# EAGLE design 2024-03-04_AD4882-to-INA317-Adapter (EAGLE 9.6.2)
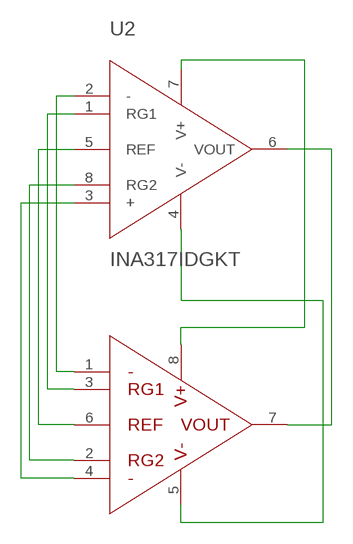
[diagram p0: schematic, sheet 1]

## Parts
U1  AD8422BRMZ-RL  [SOP65P490X110-8N]
U2  INA317IDGKT  [SOP65P490X110-8N]

## Nets
N$1: U1.1(-IN) U2.2(-)
N$2: U1.3(RG_2) U2.1(RG1)
N$3: U1.6(REF) U2.5(REF)
N$4: U1.2(RG_1) U2.8(RG2)
N$5: U1.4(+IN) U2.3(+)
N$6: U1.8(VS+) U2.7(V+)
N$7: U1.5(VS-) U2.4(V-)
N$8: U1.7(VOUT) U2.6(VOUT)

## Library data of the parts
U1 = AD8422BRMZ-RL:AD8422BRMZ-RL: INSTRUMENT AMP, 2.2MHZ, 80DB, 8 MSOP; No. of Amplifiers: 1; Input Offset Voltage: Check availability <https://pricing.snapeda.com/parts/AD8422BRMZ-RL/Analog%20Devices/view-part?ref=eda>; AVAILABILITY: In Stock; CHECK_PRICES: https://www.snapeda.com/parts/AD8422BRMZ-RL/Analog+Devices/view-part/?ref=eda; DESCRIPTION: High Performance, Low Power, Rail-to-Rail Precision Instrumentation Amplifier; MF: Analog Devices; MP: AD8422BRMZ-RL; PACKAGE: MSOP-8 Analog Devices; PRICE: None; PURCHASE-URL: https://www.snapeda.com/api/url_track_click_mouser/?unipart_id=972475&manufacturer=Analog Devices&part_name=AD8422BRMZ-RL&search_term=ad8422; SNAPEDA_LINK: https://www.snapeda.com/parts/AD8422BRMZ-RL/Analog+Devices/view-part/?ref=snap
U2 = INA317IDGKT:INA317IDGKT: Check availability <https://pricing.snapeda.com/parts/INA317IDGKT/Texas%20Instruments/view-part?ref=eda>; AVAILABILITY: In Stock; CHECK_PRICES: https://www.snapeda.com/parts/INA317IDGKT/Texas+Instruments/view-part/?ref=eda; DESCRIPTION: Micro-power (50µA), zero-drift (75µV offset, 0.3µV/˚C), precision RRO instrumentation amplifier; MF: Texas Instruments; MP: INA317IDGKT; PACKAGE: VSSOP-8 Texas Instruments; PRICE: None; PURCHASE-URL: https://www.snapeda.com/api/url_track_click_mouser/?unipart_id=3077446&manufacturer=Texas Instruments&part_name=INA317IDGKT&search_term=ina317; SNAPEDA_LINK: https://www.snapeda.com/parts/INA317IDGKT/Texas+Instruments/view-part/?ref=snap

## Board
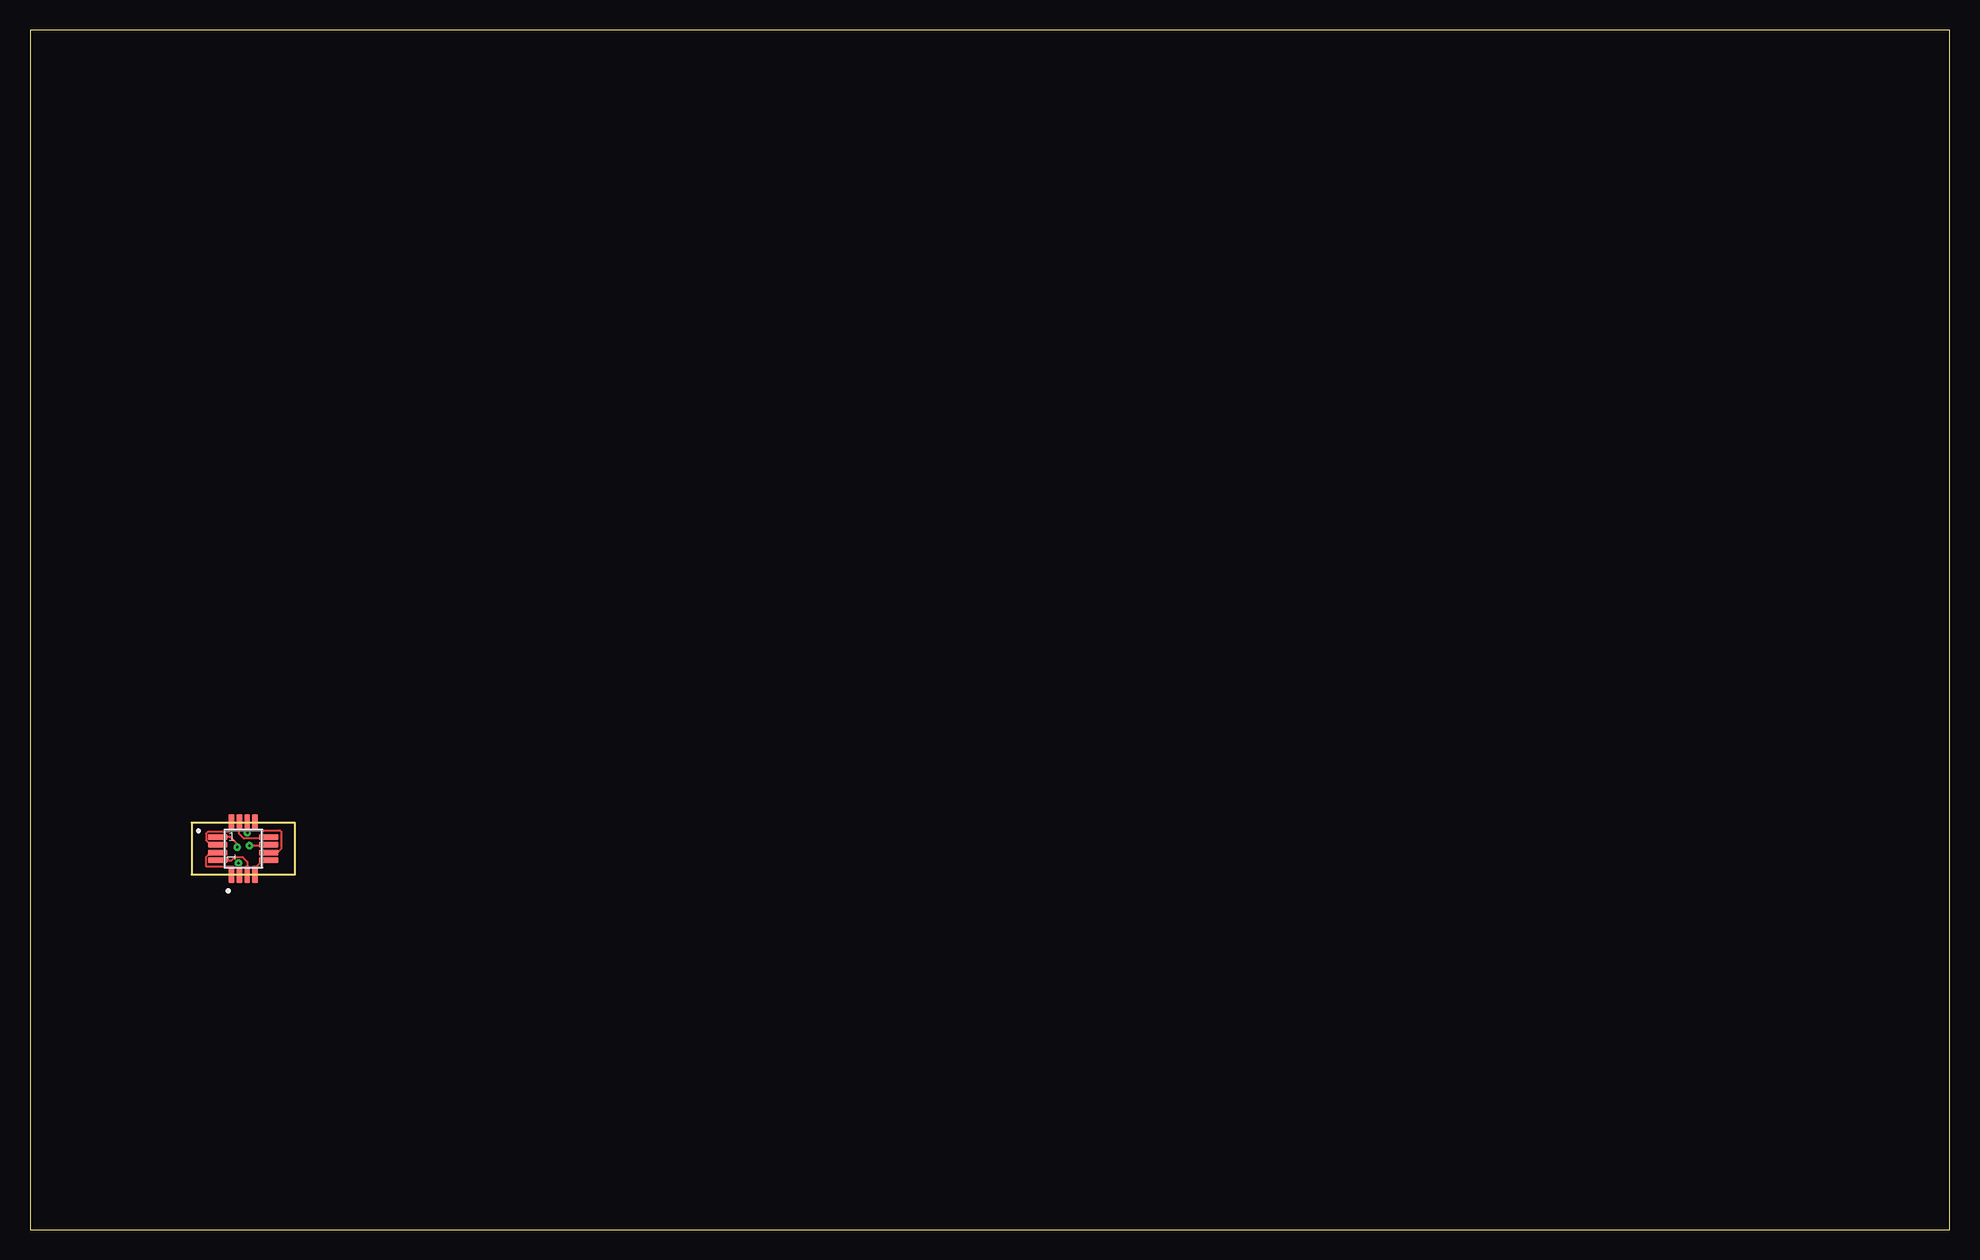
[diagram p1: board, top side]
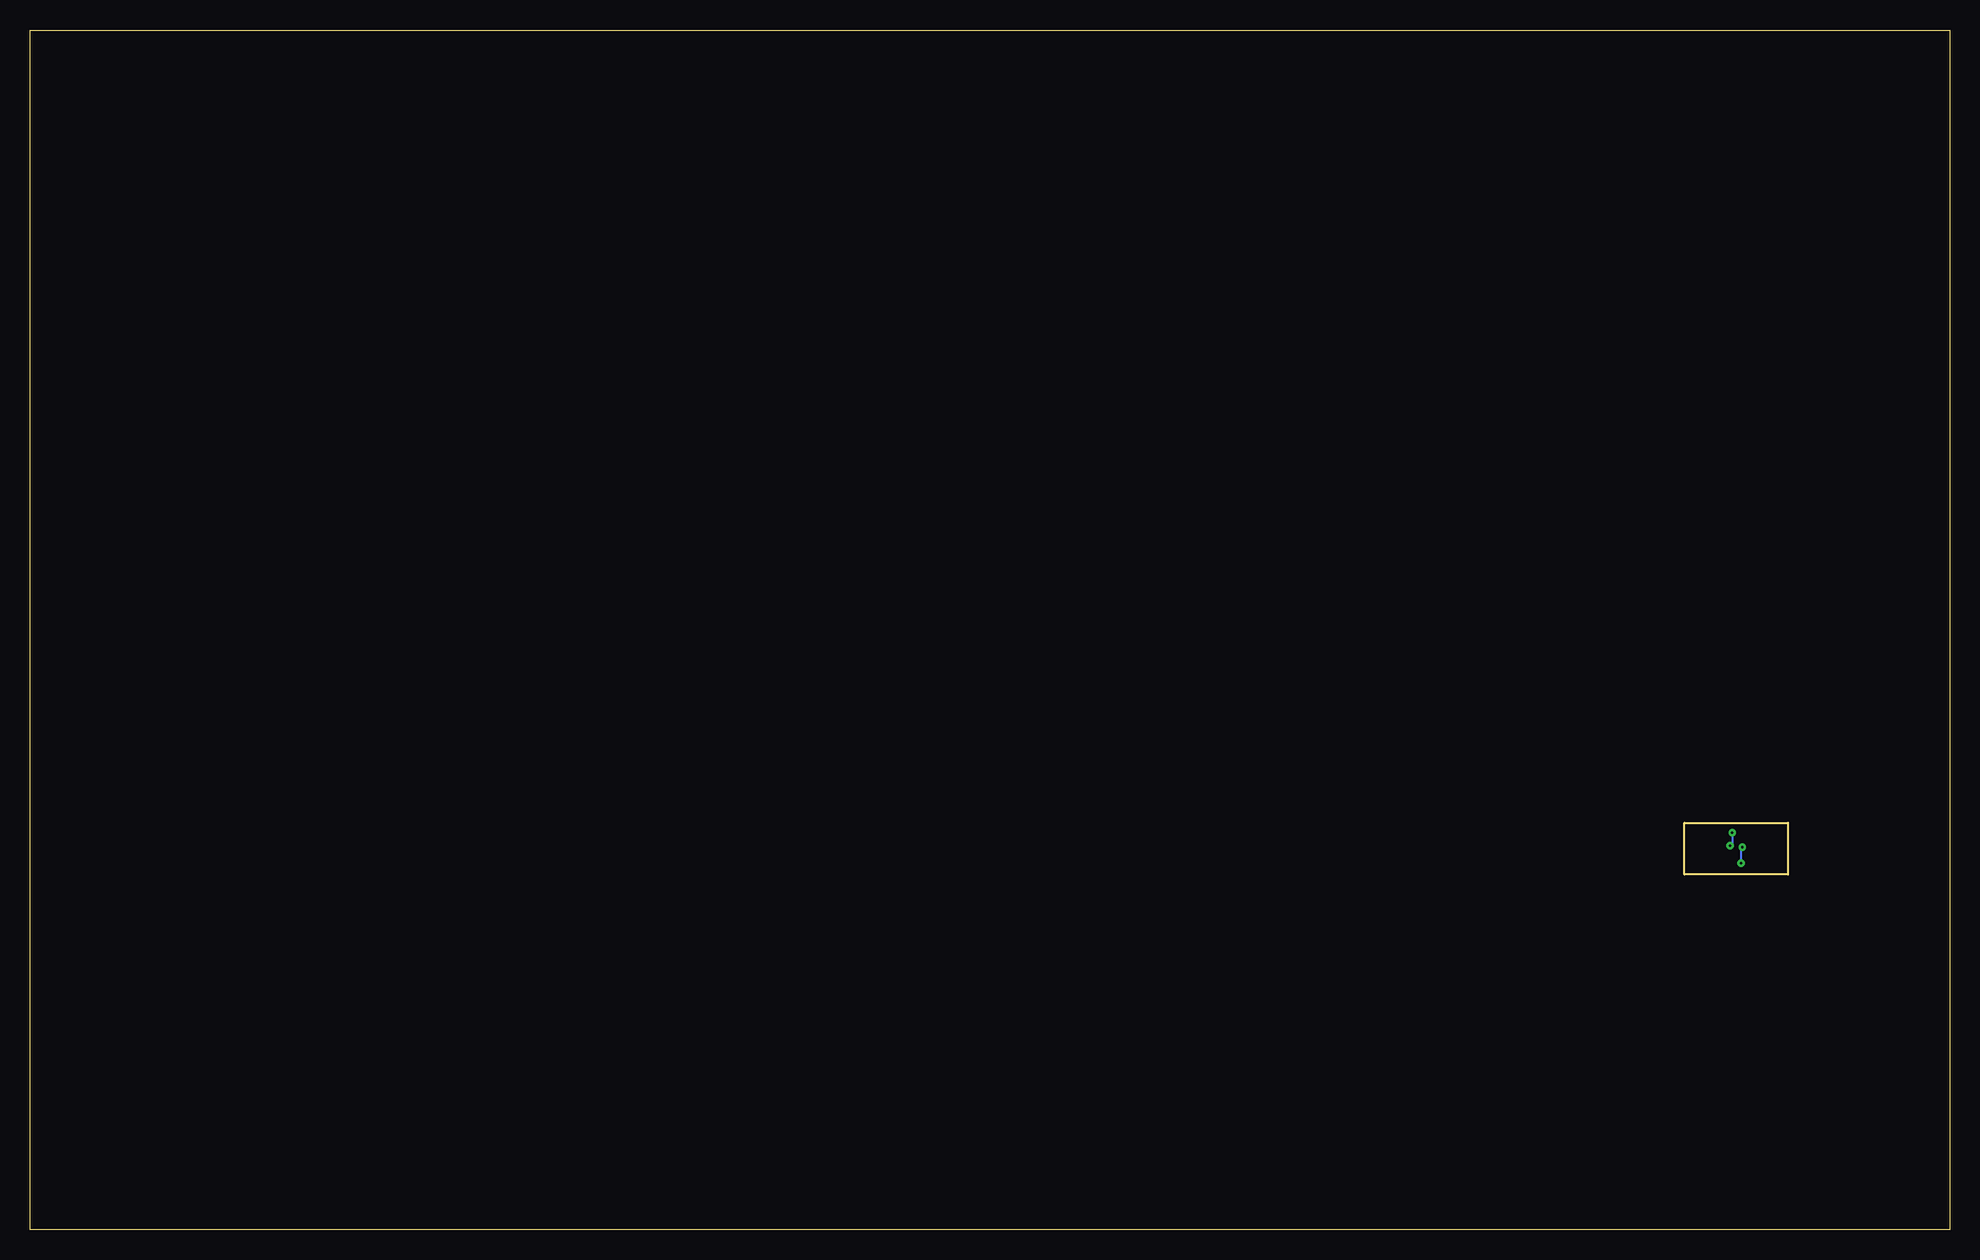
[diagram p2: board, bottom side, seen from below]

Size 160 x 100 mm. Coordinates in mm from the lower left corner, seen from the top.
Outline: 0,0 160,0 160,100 0,100 0,0
Outline: 13.46,29.59 22.1,29.59 22.1,33.91 13.46,33.91 13.46,29.59
Copper layers (1*16): Top 0.035mm / dielectric 1.5mm / Bottom 0.035mm
Design rules "default": minimum track width 0.1mm, minimum drill 0.2mm, track to track 0.1mm, track to pad 0.1mm, pad to pad 0.1mm, via to via 0.1mm, smd to smd 0mil, copper to edge 0.1mm, drill to drill 0.1mm, minimum pad ring 10mil, minimum via ring 8mil, stop-mask expansion 4mil, vias tented up to drill 0mil, thermal gap 10mil

### Footprints (pad centres in the part's own frame; a part is rotated, then mirrored left to right if it is on the bottom)
SOP65P490X110-8N = smd 1.62 x 0.5: 1 -2.12,0.975; 2 -2.12,0.325; 3 -2.12,-0.325; 4 -2.12,-0.975; 5 2.12,-0.975; 6 2.12,-0.325; 7 2.12,0.325; 8 2.12,0.975
SOP65P490X110-8N' = smd 1.47 x 0.48: 1 -2.15,0.975; 2 -2.15,0.325; 3 -2.15,-0.325; 4 -2.15,-0.975; 5 2.15,-0.975; 6 2.15,-0.325; 7 2.15,0.325; 8 2.15,0.975

### Placement (x,y rotation side)
U1  17.78,31.75 0 top
U2  INA317IDGKT  [SOP65P490X110-8N']  17.78,31.75 90 top

### Tracks (layer width: path | path; a pad name or v marks a point on that pad's centre or on a via)
N$1  (via drill 0.2 pad 0.25)
  Top 0.152: U2.2 17.45,30.42 17.27,30.61 17.31,30.61 v17.37,30.55 | v17.27,31.88 17.27,32.13 16.68,32.73 U1.1
  Bottom 0.152: v17.37,30.55 17.37,31.78 v17.27,31.88
N$2
  Top 0.152: U2.1 16.8,30.23 14.72,30.23 14.67,30.28 14.67,31.06 15.04,31.43 U1.3
N$3
  Top 0.152: U2.5 18.75,33.57 19.05,33.27 20.83,33.27 20.95,33.15 20.95,31.75 20.63,31.43 U1.6
N$4
  Top 0.152: U2.8 16.8,33.39 16.56,33.15 14.81,33.15 14.67,33.01 14.67,32.44 14.81,32.3 14.82,32.3 15.04,32.08 U1.2
N$5
  Top 0.152: U1.4 16.8,30.77 17.06,31.03 17.74,31.03 18.11,30.66 U2.3
N$6
  Top 0.152: U1.8 19.77,32.6 17.82,32.6 17.45,32.96 U2.7
N$7
  Top 0.152: U2.4 18.75,30.14 19.39,30.77 U1.5
N$8  (via drill 0.2 pad 0.25)
  Top 0.152: U2.6 v18.11,33.08 18.16,33.02 18.16,33.03 v18.11,33.08 | v18.29,32 19.83,32 U1.7
  Bottom 0.152: v18.11,33.08 18.11,32.18 v18.29,32

### Text on the board
tPlace: 1 | 1